# EAGLE design MainBoard (EAGLE 6.4)
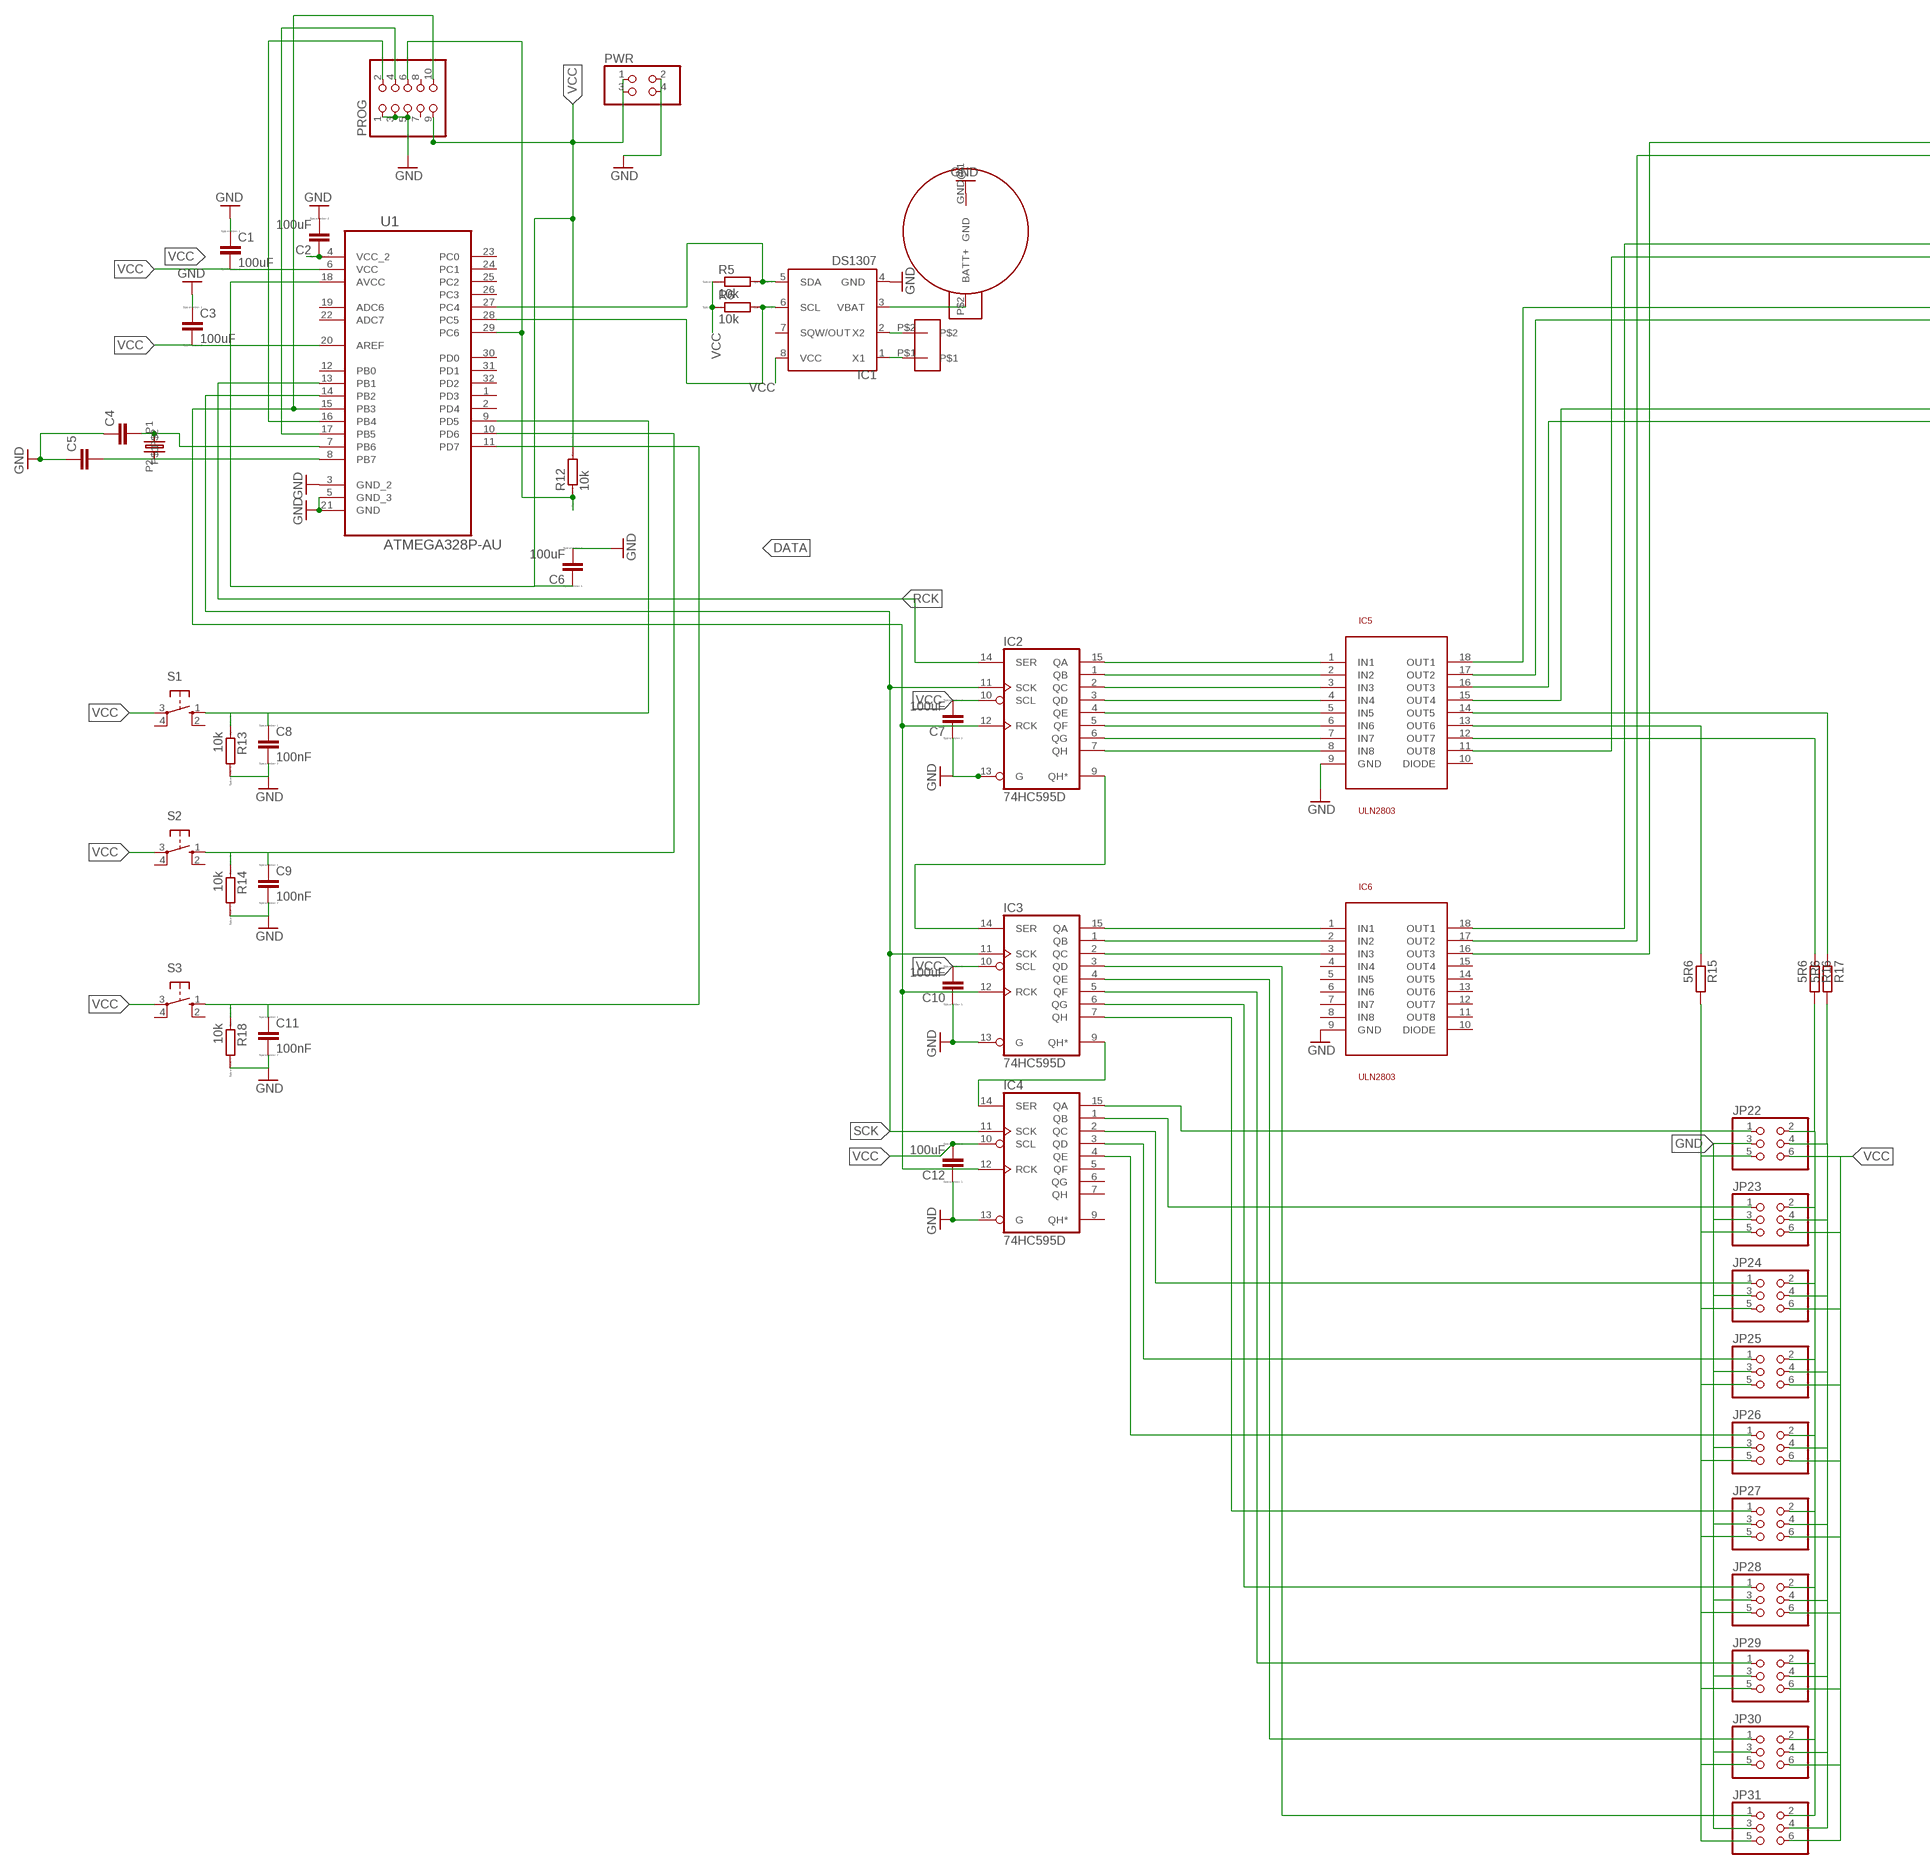
[diagram p0: schematic, sheet 1, part 1 of 2]
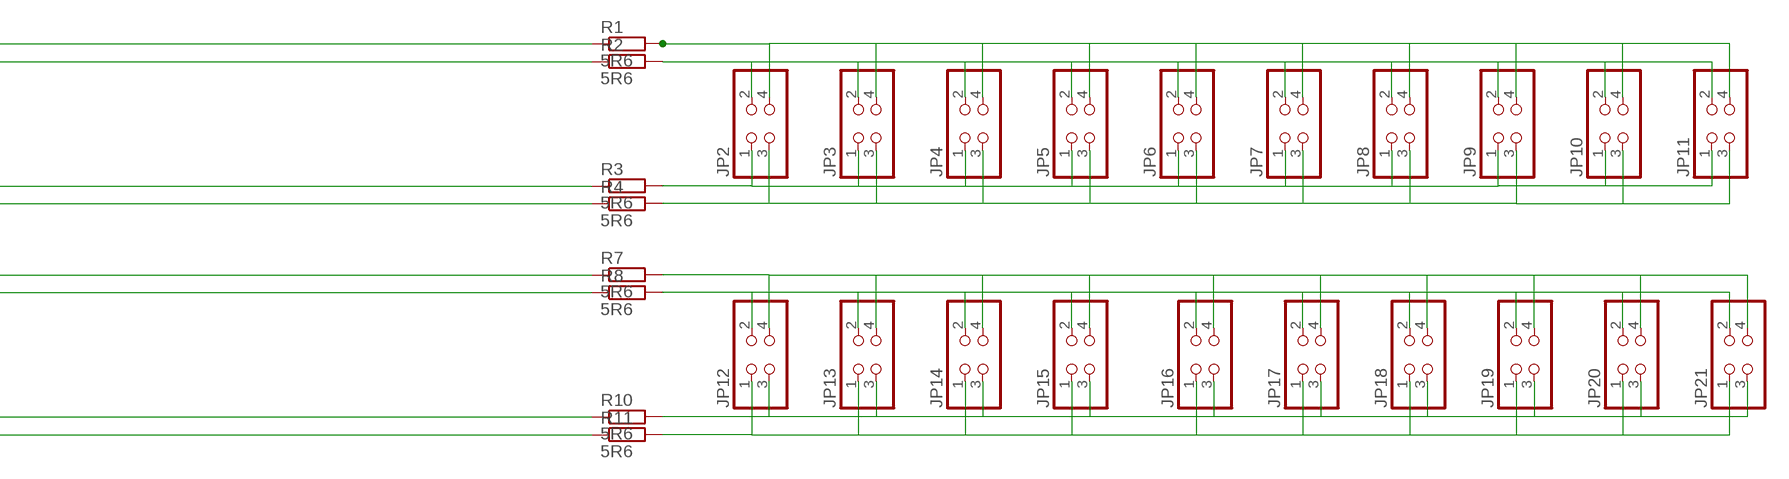
[diagram p1: schematic, sheet 1, part 2 of 2]

## Parts
C1  100uF  CC0603  [C0603]
C2  100uF  CC0603  [C0603]
C3  100uF  CC0603  [C0603]
C4  C-EUC0603  [C0603]
C5  C-EUC0603  [C0603]
C6  100uF  CC0603  [C0603]
C7  100uF  CC0603  [C0603]
C8  100nF  CC0603  [C0603]
C9  100nF  CC0603  [C0603]
C10  100uF  CC0603  [C0603]
C11  100nF  CC0603  [C0603]
C12  100uF  CC0603  [C0603]
IC1  DS1307  [SOIC-8]
IC2  74HC595D  [SO16]
IC3  74HC595D  [SO16]
IC4  74HC595D  [SO16]
IC5  ULN2803  [SO18L]
IC6  ULN2803  [SO18L]
JP2  PINHD-2X2  [2X02]
JP3  PINHD-2X2  [2X02]
JP4  PINHD-2X2  [2X02]
JP5  PINHD-2X2  [2X02]
JP6  PINHD-2X2  [2X02]
JP7  PINHD-2X2  [2X02]
JP8  PINHD-2X2  [2X02]
JP9  PINHD-2X2  [2X02]
JP10  PINHD-2X2  [2X02]
JP11  PINHD-2X2  [2X02]
JP12  PINHD-2X2  [2X02]
JP13  PINHD-2X2  [2X02]
JP14  PINHD-2X2  [2X02]
JP15  PINHD-2X2  [2X02]
JP16  PINHD-2X2  [2X02]
JP17  PINHD-2X2  [2X02]
JP18  PINHD-2X2  [2X02]
JP19  PINHD-2X2  [2X02]
JP20  PINHD-2X2  [2X02]
JP21  PINHD-2X2  [2X02]
JP22  PINHD-2X3  [2X03]
JP23  PINHD-2X3  [2X03]
JP24  PINHD-2X3  [2X03]
JP25  PINHD-2X3  [2X03]
JP26  PINHD-2X3  [2X03]
JP27  PINHD-2X3  [2X03]
JP28  PINHD-2X3  [2X03]
JP29  PINHD-2X3  [2X03]
JP30  PINHD-2X3  [2X03]
JP31  PINHD-2X3  [2X03]
PROG  PINHD-2X5  [2X05]
PWR  PINHD-2X2  [2X02]
R1  5R6  R-EU_R0805  [R0805]
R2  5R6  R-EU_R0805  [R0805]
R3  5R6  R-EU_R0805  [R0805]
R4  5R6  R-EU_R0805  [R0805]
R5  10k  RR0603  [R0603]
R6  10k  RR0603  [R0603]
R7  5R6  R-EU_R0805  [R0805]
R8  5R6  R-EU_R0805  [R0805]
R10  5R6  R-EU_R0805  [R0805]
R11  5R6  R-EU_R0805  [R0805]
R12  10k  RR0603  [R0603]
R13  10k  RR0603  [R0603]
R14  10k  RR0603  [R0603]
R15  5R6  R-EU_R0805  [R0805]
R16  5R6  R-EU_R0805  [R0805]
R17  5R6  R-EU_R0805  [R0805]
R18  10k  RR0603  [R0603]
S1  10-XX  [B3F-10XX]
S2  10-XX  [B3F-10XX]
S3  10-XX  [B3F-10XX]
U1  ATMEGA328P-AU  [QFP80P900X900X120-32N]
U$1  CR2032  [CR2023]
U$2  CC5V-T1A  [CC5V-T1A]
U$3  16,00-MT  [16,00-MT]

## Nets
DATA: IC2.14(SER) U1.13(PB1)
GND: C1.1 C2.2 C3.1 C4.1 C5.1 C6.2 C7.1 C8.2 C9.2 C10.1 C11.2 C12.1 IC1.4(GND) IC2.13(G) IC3.13(G) IC4.13(G) IC5.9(GND) IC6.9(GND) JP22.3 JP23.3 JP24.3 JP25.3 JP26.3 JP27.3 JP28.3 JP29.3 JP30.3 JP31.3 PROG.1 PROG.3 PROG.5 PWR.2 PWR.4 R13.2 R14.2 R18.2 U1.3(GND_2) U1.5(GND_3) U1.21(GND) U$1.GND@1(GND)
N$1: IC5.16(OUT3) R11.1
N$2: IC5.12(OUT7) R16.1
N$3: JP22.2 JP23.2 JP24.2 JP25.2 JP26.2 JP27.2 JP28.2 JP29.2 JP30.2 JP31.2 R16.2
N$4: IC1.2(X2) U$2.P$2
N$5: PROG.6 R12.1 U1.29(PC6)
N$6: IC5.13(OUT6) R15.1
N$7: C8.1 R13.1 S1.1(S) U1.9(PD5)
N$8: IC5.14(OUT5) R17.1
N$9: IC3.9(QH*) IC4.14(SER)
N$10: IC2.9(QH*) IC3.14(SER)
N$11: IC5.18(OUT1) R7.1
N$12: PROG.2 U1.16(PB4)
N$13: IC2.15(QA) IC5.1(IN1)
N$14: C9.1 R14.1 S2.1(S) U1.10(PD6)
N$15: C11.1 R18.1 S3.1(S) U1.11(PD7)
N$16: IC1.1(X1) U$2.P$1
N$17: C5.2 U1.8(PB7) U$3.P2
N$19: IC2.1(QB) IC5.2(IN2)
N$20: IC2.2(QC) IC5.3(IN3)
N$21: IC2.3(QD) IC5.4(IN4)
N$22: IC6.18(OUT1) R3.1
N$23: IC6.17(OUT2) R2.1
N$24: IC6.16(OUT3) R1.1
N$25: IC2.4(QE) IC5.5(IN5)
N$26: IC3.3(QD) JP31.1
N$27: IC1.3(VBAT) U$1.P$2(BATT+)
N$29: PROG.4 U1.17(PB5)
N$32: IC1.5(SDA) R5.2 U1.27(PC4)
N$34: IC2.5(QF) IC5.6(IN6)
N$36: IC2.6(QG) IC5.7(IN7)
N$38: IC4.15(QA) JP22.1
N$39: IC1.6(SCL) R6.2 U1.28(PC5)
N$40: IC4.1(QB) JP23.1
N$42: IC2.7(QH) IC5.8(IN8)
N$44: C4.2 U1.7(PB6) U$3.P1
N$45: IC3.15(QA) IC6.1(IN1)
N$47: JP12.1 JP13.1 JP14.1 JP15.1 JP16.1 JP17.1 JP18.1 JP19.1 JP20.1 JP21.1 R11.2
N$48: IC3.1(QB) IC6.2(IN2)
N$49: IC3.2(QC) IC6.3(IN3)
N$50: IC5.15(OUT4) R10.1
N$51: JP12.3 JP13.3 JP14.3 JP15.3 JP16.3 JP17.3 JP18.3 JP19.3 JP20.3 JP21.3 R10.2
N$52: JP22.5 JP23.5 JP24.5 JP25.5 JP26.5 JP27.5 JP28.5 JP29.5 JP30.5 JP31.5 R15.2
N$53: IC5.11(OUT8) R4.1
N$54: IC5.17(OUT2) R8.1
N$56: IC4.2(QC) JP24.1
N$57: IC4.3(QD) JP25.1
N$58: IC4.4(QE) JP26.1
N$60: IC3.7(QH) JP27.1
N$62: IC3.6(QG) JP28.1
N$69: IC3.5(QF) JP29.1
N$70: IC3.4(QE) JP30.1
N$71: JP2.1 JP3.1 JP4.1 JP5.1 JP6.1 JP7.1 JP8.1 JP9.1 JP10.1 JP11.1 R3.2
N$72: JP22.4 JP23.4 JP24.4 JP25.4 JP26.4 JP27.4 JP28.4 JP29.4 JP30.4 JP31.4 R17.2
N$74: JP2.3 JP3.3 JP4.3 JP5.3 JP6.3 JP7.3 JP8.3 JP9.3 JP10.3 JP11.3 R4.2
N$76: JP2.2 JP3.2 JP4.2 JP5.2 JP6.2 JP7.2 JP8.2 JP9.2 JP10.2 JP11.2 R2.2
N$77: JP2.4 JP3.4 JP4.4 JP5.4 JP6.4 JP7.4 JP8.4 JP9.4 JP10.4 JP11.4 R1.2
N$80: JP12.2 JP13.2 JP14.2 JP15.2 JP16.2 JP17.2 JP18.2 JP19.2 JP20.2 JP21.2 R8.2
N$81: JP12.4 JP13.4 JP14.4 JP15.4 JP16.4 JP17.4 JP18.4 JP19.4 JP20.4 JP21.4 R7.2
RCK: IC2.12(RCK) IC3.12(RCK) IC4.12(RCK) PROG.10 U1.15(PB3)
SCK: IC2.11(SCK) IC3.11(SCK) IC4.11(SCK) U1.14(PB2)
VCC: C1.2 C2.1 C3.2 C6.1 C7.2 C10.2 C12.2 IC1.8(VCC) IC2.10(SCL) IC3.10(SCL) IC4.10(SCL) JP22.6 JP23.6 JP24.6 JP25.6 JP26.6 JP27.6 JP28.6 JP29.6 JP30.6 JP31.6 PROG.9 PWR.1 PWR.3 R5.1 R6.1 R12.2 S1.3(P) S2.3(P) S3.3(P) U1.4(VCC_2) U1.6(VCC) U1.18(AVCC) U1.20(AREF)
Unconnected: IC1.7(SQW/OUT) IC4.5(QF) IC4.6(QG) IC4.7(QH) IC4.9(QH*) IC5.10(DIODE) IC6.4(IN4) IC6.5(IN5) IC6.6(IN6) IC6.7(IN7) IC6.8(IN8) IC6.10(DIODE) IC6.11(OUT8) IC6.12(OUT7) IC6.13(OUT6) IC6.14(OUT5) IC6.15(OUT4) PROG.7 PROG.8 S1.2(S1) S1.4(P1) S2.2(S1) S2.4(P1) S3.2(S1) S3.4(P1) U1.1(PD3) U1.2(PD4) U1.12(PB0) U1.19(ADC6) U1.22(ADC7) U1.23(PC0) U1.24(PC1) U1.25(PC2) U1.26(PC3) U1.30(PD0) U1.31(PD1) U1.32(PD2)

## Power pins joined to a net without a drawn wire
GND: IC2.8(GND) IC3.8(GND) IC4.8(GND)
VCC: IC2.16(VCC) IC3.16(VCC) IC4.16(VCC)

## Library data of the parts
C1-C3 C6-C12 = eagle-ltspice:C: CAPACITOR, European symbol; SPICEMODEL: NONE; SPICEPREFIX: C
C4 C5 = rcl:C-EU: CAPACITOR, European symbol
IC1 = dallas:DS1307: I2C Serial RTC w/56 bytes battery backed RAM
IC2-IC4 = 74xx-eu:74*595: 8-bit SHIFT REGISTER, output latch
IC5 IC6 = uln2803:ULN2803
JP2-JP21 PWR = pinhead:PINHD-2X2: PIN HEADER
JP22-JP31 = pinhead:PINHD-2X3: PIN HEADER
PROG = pinhead:PINHD-2X5: PIN HEADER
R1-R4 R7 R8 R10 R11 R15-R17 = resistor:R-EU_: RESISTOR, European symbol
R5 R6 R12-R14 R18 = eagle-ltspice:R: RESISTOR, European symbol; SPICEMODEL: NONE; SPICEPREFIX: R
S1-S3 = switch-omron:10-XX: OMRON SWITCH; MPN: B3F-1000; OC_FARNELL: 176432; OC_NEWARK: 36M3542
U1 = Atmel_By_element14_Batch_1:ATMEGA328P-AU: 8-bit Microcontroller with In-System Programmable Flash; MPN: ATMEGA328P-AU; OC_FARNELL: 1715486; OC_NEWARK: 14R4631; PACKAGE: TQFP-32; SUPPLIER: Atmel
U$1 = 2032:CR2032
U$2 = cc5v-t1a:CC5V-T1A
U$3 = 1600MT:16,00-MT

## Net classes
0 default: width 0.127 mm, drill 0.508 mm, clearance 0.127 mm

## Board
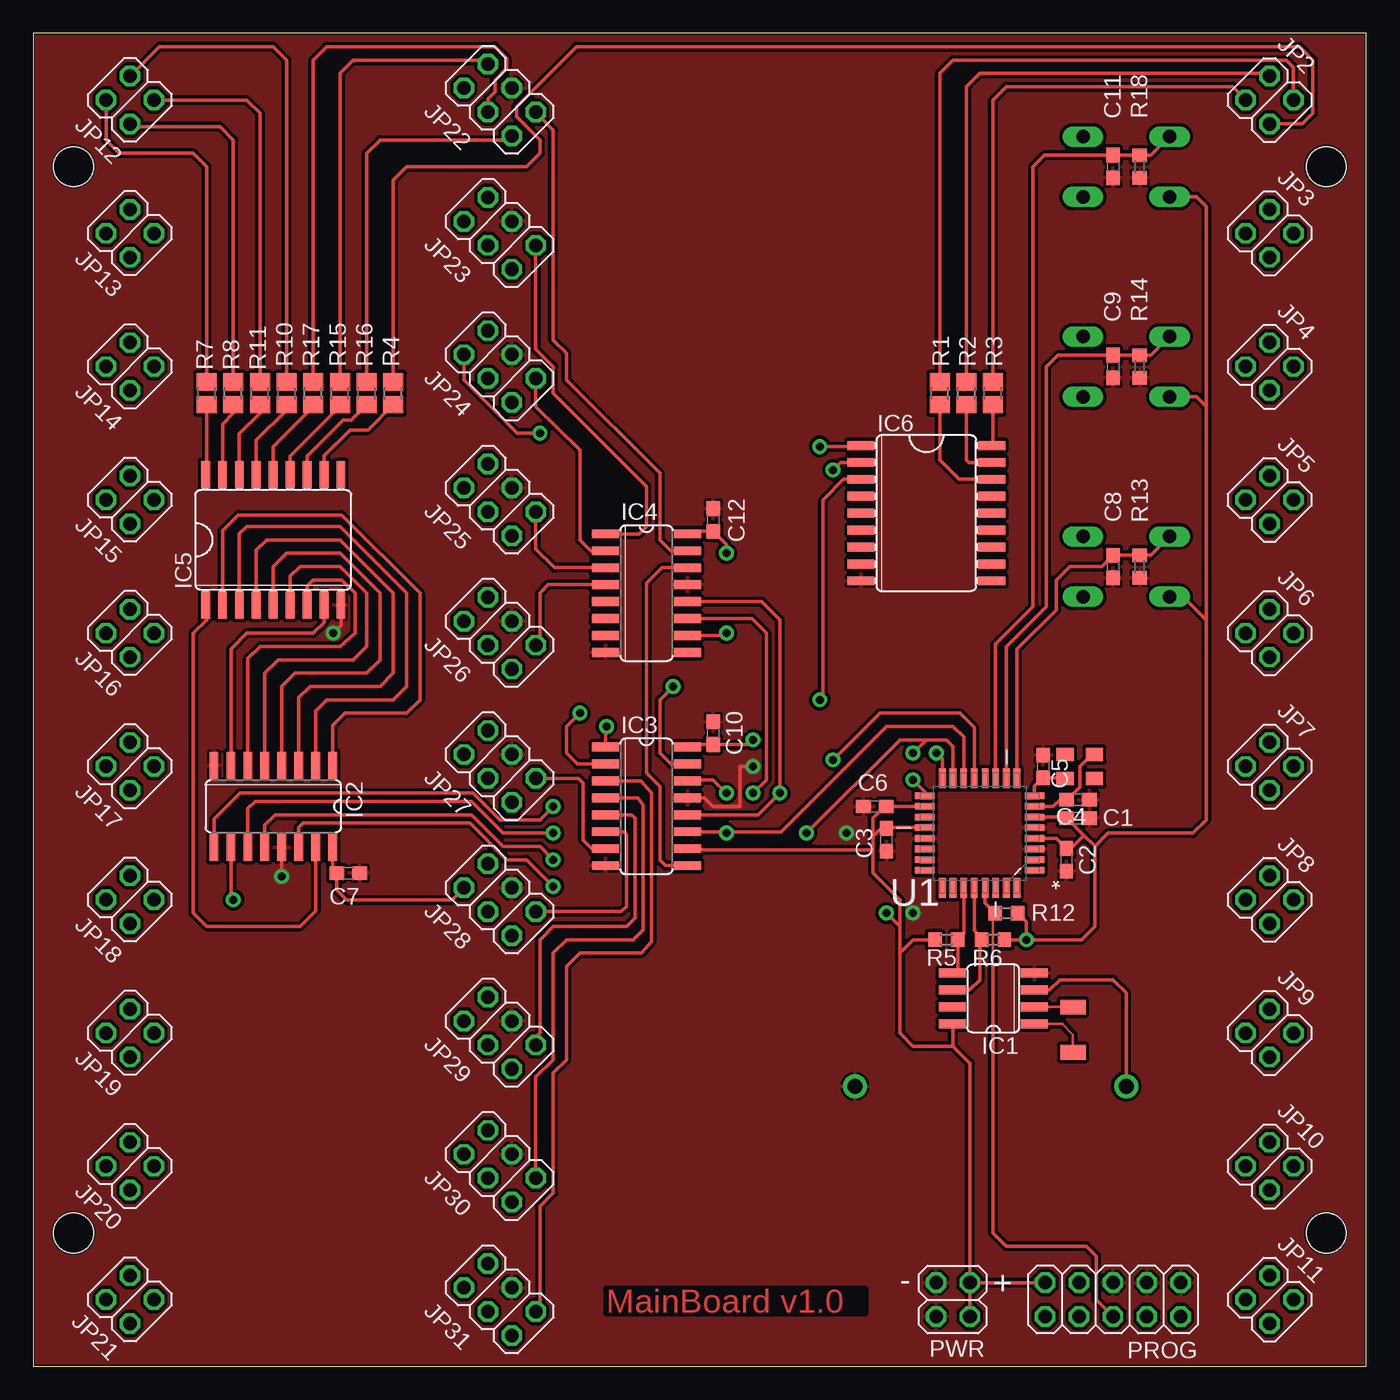
[diagram p2: board, top side]
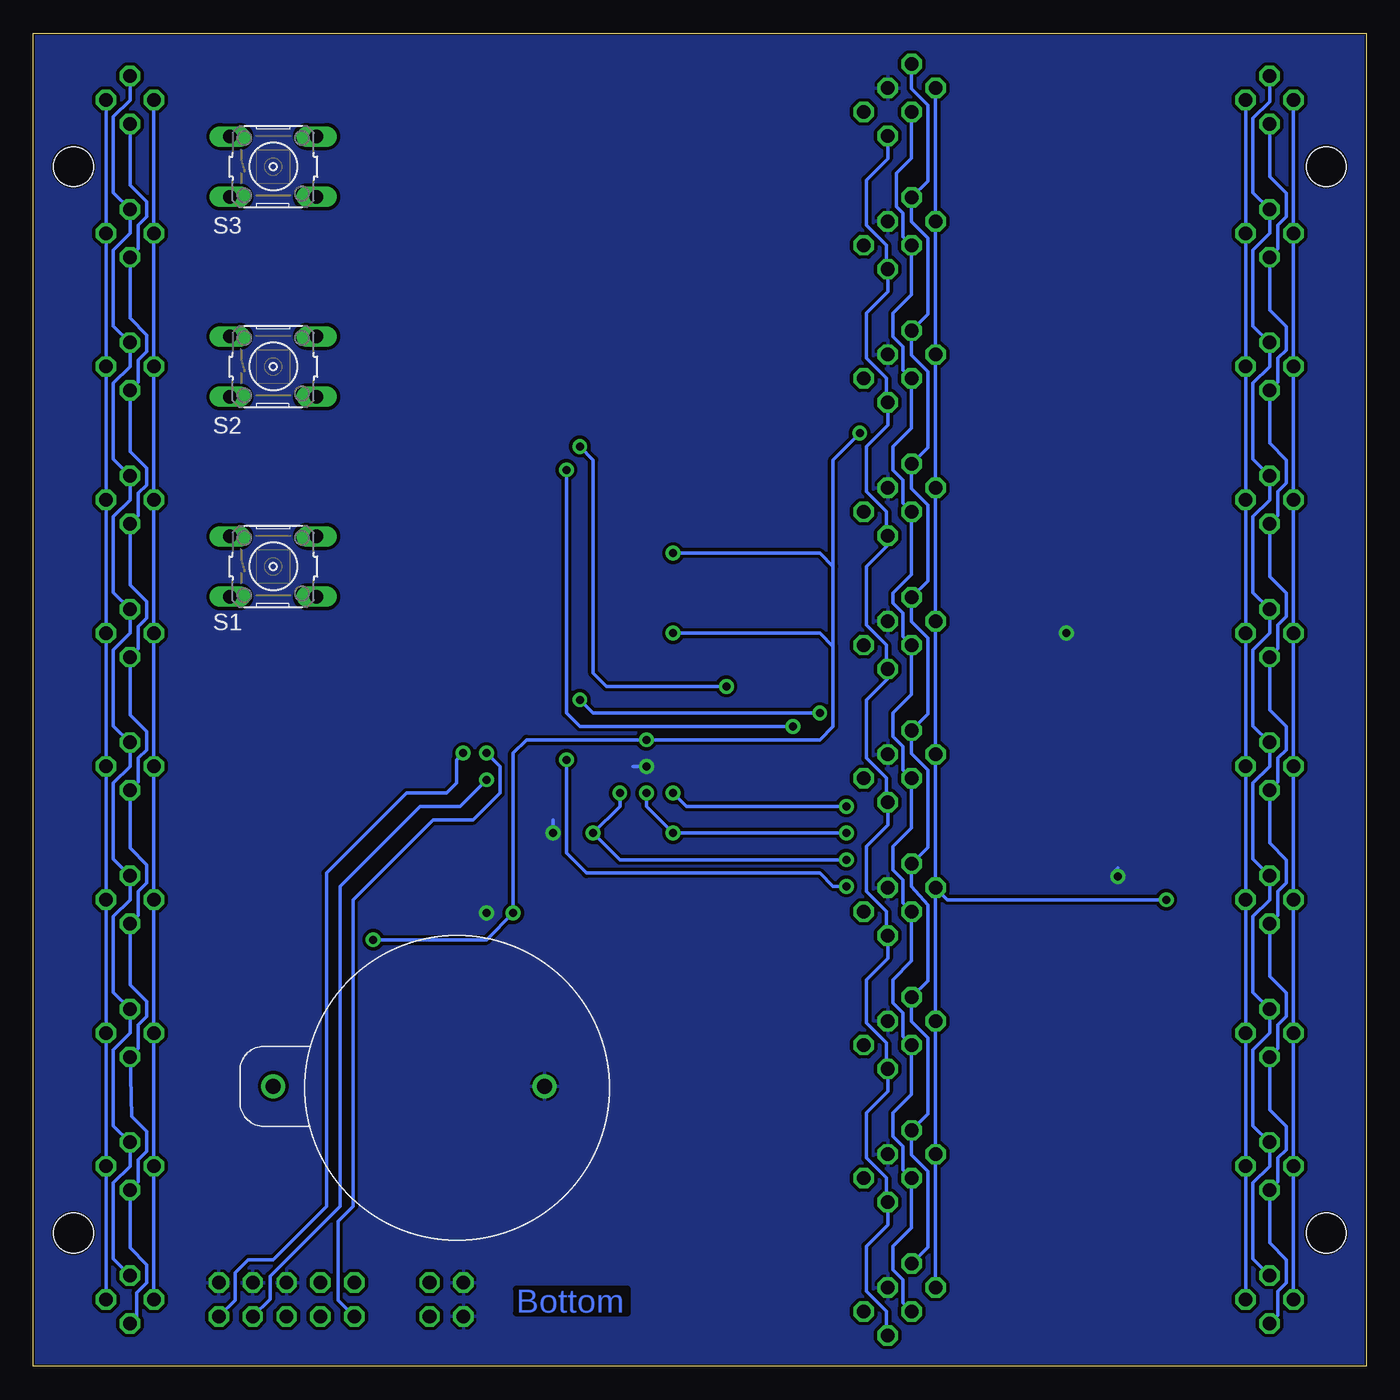
[diagram p3: board, bottom side, seen from below]

Size 100 x 100 mm. Coordinates in mm from the lower left corner, seen from the top.
Outline: 0,0 100,0 100,100 0,100 0,0
Copper layers (1+2*15+16): Top 0.035mm / dielectric 0.2mm / Route2 0.035mm / dielectric 1.4mm / Route15 0.035mm / dielectric 0.2mm / Bottom 0.035mm
Design rules "mohome *": minimum track width 5mil, minimum drill 12mil, track to track 10mil, track to pad 10mil, pad to pad 10mil, via to via 10mil, smd to smd 10mil, copper to edge 5mil, drill to drill 8mil, minimum pad ring 10mil, minimum via ring 10mil, stop-mask expansion 3mil, vias tented up to drill 0mil, thermal gap 8mil
Holes 3 mm at 3,10 3,90 97,90 97,10

### Footprints (pad centres in the part's own frame; a part is rotated, then mirrored left to right if it is on the bottom)
C0603 = smd 1.1 x 1: 1 -0.85,0; 2 0.85,0
SOIC-8 = smd 2.032 x 0.66: 1 -3.073,1.27; 2 -3.073,0; 3 -3.073,-1.27; 4 -3.073,-2.54; 5 3.073,-2.54; 6 3.073,-1.27; 7 3.073,0; 8 3.073,1.27
SO16 = smd 0.66 x 2.032: 1 -4.445,-3.073; 2 -3.175,-3.073; 3 -1.905,-3.073; 4 -0.635,-3.073; 5 0.635,-3.073; 6 1.905,-3.073; 7 3.175,-3.073; 8 4.445,-3.073; 9 4.445,3.073; 10 3.175,3.073; 11 1.905,3.073; 12 0.635,3.073; 13 -0.635,3.073; 14 -1.905,3.073; 15 -3.175,3.073; 16 -4.445,3.073
SO18L = smd 0.66 x 2.032: 1 -5.08,-4.902; 2 -3.81,-4.902; 3 -2.54,-4.902; 4 -1.27,-4.902; 5 0,-4.902; 6 1.27,-4.902; 7 2.54,-4.902; 8 3.81,-4.902; 9 5.08,-4.902; 10 5.08,4.902; 11 3.81,4.902; 12 2.54,4.902; 13 1.27,4.902; 14 0,4.902; 15 -1.27,4.902; 16 -2.54,4.902; 17 -3.81,4.902; 18 -5.08,4.902
2X02 = drill 1.016 octagon: 1 -1.27,-1.27; 2 -1.27,1.27; 3 1.27,-1.27; 4 1.27,1.27
2X03 = drill 1.016 octagon: 1 -2.54,-1.27; 2 -2.54,1.27; 3 0,-1.27; 4 0,1.27; 5 2.54,-1.27; 6 2.54,1.27
2X05 = drill 1.016 octagon: 1 -5.08,-1.27; 2 -5.08,1.27; 3 -2.54,-1.27; 4 -2.54,1.27; 5 0,-1.27; 6 0,1.27; 7 2.54,-1.27; 8 2.54,1.27; 9 5.08,-1.27; 10 5.08,1.27
R0805 = smd 1.3 x 1.5: 1 -0.85,0; 2 0.85,0
R0603 = smd 1 x 1.1: 1 -0.85,0; 2 0.85,0
B3F-10XX = drill 1.016 long: 1 -3.251,2.261; 2 3.251,2.261; 3 -3.251,-2.261; 4 3.251,-2.261
QFP80P900X900X120-32N = smd 1.473 x 0.508: 1 -4.115,2.794; 2 -4.115,2.007; 3 -4.115,1.194; 4 -4.115,0.406; 5 -4.115,-0.406; 6 -4.115,-1.194; 7 -4.115,-2.007; 8 -4.115,-2.794; 17 4.115,-2.794; 18 4.115,-2.007; 19 4.115,-1.194; 20 4.115,-0.406; 21 4.115,0.406; 22 4.115,1.194; 23 4.115,2.007; 24 4.115,2.794 | smd 0.508 x 1.473: 9 -2.794,-4.115; 10 -2.007,-4.115; 11 -1.194,-4.115; 12 -0.406,-4.115; 13 0.406,-4.115; 14 1.194,-4.115; 15 2.007,-4.115; 16 2.794,-4.115; 25 2.794,4.115; 26 2.007,4.115; 27 1.194,4.115; 28 0.406,4.115; 29 -0.406,4.115; 30 -1.194,4.115; 31 -2.007,4.115; 32 -2.794,4.115
CR2023 = drill 1.143 pad 1.778: GND@1 0,5.35; P$2 0,-15
CC5V-T1A = smd 1.1 x 1.9: P$1 -1.7,0; P$2 1.7,0
16,00-MT = smd 1.3 x 1: NC1 1.1,-0.9; NC2 -1.1,0.9; P1 -1.1,-0.9; P2 1.1,0.9

### Placement (x,y rotation side)
C1  78.38,41.12 180 top
C2  77.5,38 270 top
C3  64,39.5 90 top
C4  78.38,42.5 180 top
C5  75.75,45 270 top
C6  63.12,42 180 top
C7  23.62,37 180 top
C8  81,60 270 top
C9  81,75 270 top
C10  51,47.5 270 top
C11  81,90 270 top
C12  51,63.5 270 top
IC1  72.02,26.95 180 top
IC2  18,42 180 top
IC3  46,42 270 top
IC4  46,58 270 top
IC5  18,62 0 top
IC6  67,64 270 top
JP2  92.75,95 315 top
JP3  92.75,85 315 top
JP4  92.75,75 315 top
JP5  92.75,65 315 top
JP6  92.75,55 315 top
JP7  92.75,45 315 top
JP8  92.75,35 315 top
JP9  92.75,25 315 top
JP10  92.75,15 315 top
JP11  92.75,5 315 top
JP12  7.25,95 135 top
JP13  7.25,85 135 top
JP14  7.25,75 135 top
JP15  7.25,65 135 top
JP16  7.25,55 135 top
JP17  7.25,45 135 top
JP18  7.25,35 135 top
JP19  7.25,25 135 top
JP20  7.25,15 135 top
JP21  7.25,5 135 top
JP22  35,95 135 top
JP23  35,85 135 top
JP24  35,75 135 top
JP25  35,65 135 top
JP26  35,55 135 top
JP27  35,45 135 top
JP28  35,35 135 top
JP29  35,25 135 top
JP30  35,15 135 top
JP31  35,5 135 top
PROG  81,5 180 top
PWR  69,5 90 top
R1  68,73 90 top
R2  70,73 90 top
R3  72,73 90 top
R4  27,73 90 top
R5  68.5,32 0 top
R6  72,32 180 top
R7  13,73 90 top
R8  15,73 90 top
R10  19,73 90 top
R11  17,73 90 top
R12  73,34 0 top
R13  83,60 270 top
R14  83,75 270 top
R15  23,73 90 top
R16  25,73 90 top
R17  21,73 90 top
R18  83,90 270 top
S1  82,60 0 bottom
S2  82,75 0 bottom
S3  82,90 0 bottom
U1  71,40 180 top
U$1  67,21 270 bottom
U$2  78,25.25 90 top
U$3  78.5,45 180 top

### Tracks (layer width: path | path; a pad name or v marks a point on that pad's centre or on a via)
DATA  (via drill 0.6)
  Top 0.254: v60,45.5 63.5,49 69.5,49 70.59,47.91 U1.13 | IC2.14 19.91,40.41 20.25,40.75 32.75,40.75 35.5,38 37,38 v39,36
  Bottom 0.254: v39,36 40,36 41,37 58.5,37 60,38.5 v60,45.5
GND  (via drill 0.6)
  Top 0.254: 60.75,39.62 v61,40 | IC5.9 23.08,55.58 v22.5,55 | IC2.13 18.64,37.51 v18.62,36.75 | IC3.13 50.37,42.63 51,42 53,42 53,45 v54,45
  Bottom 0.254: v61,40 61,41 | v22.5,55 23,55 | v18.62,36.75 18.62,37.38 19,37 | v54,45 55,45
  other vias: 66,34
  pour Top: -1.54,100.87 -2,-5 103,-2 103,105
  pour Bottom: 104,103 -2,102 -5,-4 106,-3
N$1
  Top 0.254: IC5.16 15.46,69.96 17,71.5 R11.1
N$2
  Top 0.254: IC5.12 20.54,68.29 23.25,71 23.85,71 R16.1
N$3
  Top 0.254: JP22.2 35.59,92 26,92 25,91 R16.2
  Bottom 0.254: JP22.2 35.9,90.6 37.5,89 37.5,85.62 36,84.12 36,82.41 JP23.2 35.9,80.6 37.5,79 37.5,75.62 36,74.12 36,72.41 JP24.2 35.9,70.6 37.5,69 37.5,65.62 36,64.12 36,62.41 JP25.2 35.9,61.6 37.5,60 37.5,55.62 36,54.12 36,52.41 JP26.2 35.9,51.6 37.5,50 37.5,45.62 36,44.12 36,42.41 JP27.2 35.9,40.6 37.5,39 37.5,35.62 36,34.12 36,32.41 JP28.2 35.9,30.6 37.5,29 37.5,25.75 36,24.25 36,22.41 JP29.2 35.9,20.6 37.5,19 37.5,15.62 36,14.12 36,12.41 JP30.2 35.9,10.6 37.5,9 37.5,5.62 36,4.12 36,2.41 JP31.2
N$4
  Top 0.203: IC1.2 76.1,26.95 U$2.P$2
N$5
  Top 0.178: 72,30 72,33.85
  Top 0.254: PROG.6 81,3.75 79.75,5 79.75,8.25 79,9 73,9 72,10 72,30 | U1.29 71.41,34.74 R12.1 72,33.85
N$6
  Top 0.254: IC5.13 19.27,68.27 22.9,71.9 R15.1
N$7
  Top 0.254: U1.9 73.79,53.79 76.75,56.75 76.75,59 77.75,60 80.15,60 C8.1 R13.1 83.84,60.85 S1.1
N$8
  Top 0.254: IC5.14 18,69 21,72 R17.1
N$9
  Top 0.254: IC4.14 47.16,59.91 46,58.75 46,44.5 47,43.5 47,38 47.45,37.55 IC3.9
N$10  (via drill 0.6)
  Top 0.254: IC2.9 13.55,41.05 15.5,43 33,43 35,41 38,41 v39,42 | v52,43 51,44 49.17,44 IC3.14
  Bottom 0.254: v39,42 51,42 v52,43
N$11
  Top 0.254: R7.1 13,66.98 IC5.18
N$12  (via drill 0.6)
  Top 0.254: U1.16 68.21,45.54 v67.75,46
  Bottom 0.254: v67.75,46 68.25,45.5 68.25,43.75 69,43 72,43 78,37 78,12 82,8 83.88,8 84.88,7 84.88,4.93 PROG.2
N$13
  Top 0.254: IC5.1 13,57.18 13,56 12,55 12,34 13,33 20,33 21.18,34.17 IC2.15
N$14
  Top 0.254: U1.10 73.01,54.01 76,57 76,75 76.85,75.85 C9.1 R14.1 83.84,75.85 S2.1
N$15
  Top 0.254: U1.11 72.19,54.19 75,57 75,90 75.85,90.85 C11.1 R18.1 83.84,90.85 S3.1
N$16
  Top 0.203: U$2.P$1 78,24.88 77.19,25.68 IC1.1
N$17
  Top 0.254: U1.8 75.11,43.52 C5.2 77.35,44.15 U$3.P2
N$19
  Top 0.254: IC5.2 14.19,62.69 15.38,63.88 23.12,63.88 29,58 29,50 28,49 23.38,49 22.45,48.07 IC2.1
N$20
  Top 0.254: IC5.3 15.46,62.46 16,63 23,63 28,58 28,51 27,50 22,50 21.18,49.17 IC2.2
N$21
  Top 0.254: IC5.4 16.73,61.23 17.5,62 23,62 27,58 27,52 26,51 20.75,51 19.91,50.16 IC2.3
N$22
  Top 0.254: IC6.18 72,69.18 R3.1
N$23
  Top 0.254: IC6.17 70.19,67.81 70,68 R2.1
N$24
  Top 0.254: IC6.16 69.46,66.54 68,68 R1.1
N$25
  Top 0.254: IC5.5 18,60 19,61 23,61 26,58 26,53 25,52 19.62,52 18.64,51.01 IC2.4
N$26
  Top 0.254: JP31.1 38,4.5 38,12 39,13 39,22 40,23 40,30 41,31 45.62,31 46.38,31.88 46.38,43 45.59,43.91 IC3.3
N$27
  Top 0.254: U$1.P$2 82,28 81,29 77,29 76.22,28.23 IC1.3
N$29  (via drill 0.6)
  Top 0.254: U1.17 67.21,42.79 v66,44
  Bottom 0.254: v66,44 68,42 71,42 77,36 77,12 82.25,6.75 82.25,5.02 PROG.4
N$32
  Top 0.254: U1.27 69.81,32.46 R5.2 69.35,29.9 IC1.5
N$34
  Top 0.254: IC5.6 19.27,59.27 20,60 23,60 25,58 25,54 24,53 18.38,53 17.36,51.99 IC2.5
N$36
  Top 0.254: IC5.7 20.54,58.54 21,59 23.12,59 24.12,58 24.12,55 23,54 17,54 16.09,53.09 IC2.6
N$38
  Top 0.254: JP22.1 39,92.75 39,77 40,76 40,74 47,67 47,62 47.83,61.17 IC4.15
N$39
  Top 0.254: U1.28 70.59,32.68 R6.2 71,31.85 71,29 70.22,28.23 IC1.6
N$40
  Top 0.254: JP23.1 37.69,76.31 39,75 39,73 46,66 46,63 45.45,62.45 IC4.1
N$42
  Top 0.254: IC5.8 21.81,55.81 21,55 16,55 14.82,53.83 IC2.7
N$44
  Top 0.254: U1.7 76.51,42.01 77,42.5 C4.2 78.5,43.48 78.5,45 79.4,45.9 U$3.P1
N$45  (via drill 0.6)
  Top 0.254: IC3.15 47.83,45.17 47,46 47,50 v48,51 | v59,69 62.02,69 IC6.1
  Bottom 0.254: v48,51 57,51 58,52 58,68 v59,69
N$47
  Top 0.254: R11.2 17,94 16,95 JP12.1
  Bottom 0.254: JP12.1 JP13.1 JP14.1 JP15.1 JP16.1 JP17.1 JP18.1 JP19.1 JP20.1 JP21.1
N$48  (via drill 0.6)
  Top 0.254: IC3.1 42.93,47.93 v43,48 | IC6.2 60.56,67.81 v60,67.25
  Bottom 0.254: v43,48 59,48 60,49 v60,67.25
N$49  (via drill 0.6)
  Top 0.254: IC3.2 40.83,45.17 40,46 40,48 v41,49 | v59,50 59.25,50.25 59.25,65 60.79,66.54 IC6.3
  Bottom 0.254: v41,49 58,49 v59,50
N$50
  Top 0.254: IC5.15 16.73,69.48 19,71.75 R10.1
N$51
  Top 0.254: R10.2 19,98 18,99 9.45,99 JP12.3
  Bottom 0.254: JP12.3 7.25,94.88 8.5,93.62 8.5,88.05 JP13.3 7.25,85 8.5,83.75 8.5,78.05 JP14.3 7.25,75 8.5,73.75 8.5,68.05 JP15.3 7.25,65 8.5,63.75 8.5,58.05 JP16.3 7.25,55 8.5,53.75 8.5,48.05 JP17.3 7.25,45 8.5,43.75 8.5,38.05 JP18.3 7.25,35 8.5,33.75 8.5,28.05 JP19.3 7.25,25 8.5,23.75 8.5,18.05 JP20.3 7.25,15 8.5,13.75 8.5,8.05 JP21.3
N$52
  Top 0.254: JP22.5 33.8,98 24,98 23,97 R15.2
  Bottom 0.254: JP22.5 34.1,95.85 32.88,94.62 32.88,88.92 JP23.5 34.1,85.85 32.88,84.62 32.88,78.92 JP24.5 34.1,75.85 32.88,74.62 32.88,68.92 JP25.5 34.1,65.85 32.88,64.62 32.88,58.92 JP26.5 34.1,55.85 32.88,54.62 32.88,48.92 JP27.5 34.1,45.98 32.88,44.75 32.88,38.92 JP28.5 34.1,35.98 32.88,34.62 32.88,28.92 JP29.5 34.1,25.85 32.88,24.62 32.88,18.92 JP30.5 34.1,15.85 32.88,14.62 32.88,8.92 JP31.5
N$53
  Top 0.254: IC5.11 21.81,68.31 23.75,70.25 25.1,70.25 R4.1
N$54
  Top 0.254: IC5.17 14.19,70.69 15,71.5 R8.1
N$56
  Top 0.254: JP24.1 37.69,72 41,68.75 41,62 41.83,61.17 IC4.2
N$57
  Top 0.254: IC4.3 39.09,59.91 37.69,61.31 JP25.1
N$58
  Top 0.254: JP26.1 38,54.41 38,58 38.63,58.63 IC4.4
N$60
  Top 0.254: JP27.1 40.9,44.1 41.25,43.75 41.25,39.5 41.92,38.83 IC3.7
N$62
  Top 0.254: IC3.6 44.41,40.09 44.5,39.88 44.5,34.5 44.1,34.1 JP28.1
N$69
  Top 0.254: IC3.5 44.88,41.37 45.12,41.12 45.12,33.62 44.5,33 39,33 38,32 38,25 37.69,24.69 JP29.1
N$70
  Top 0.254: IC3.4 45.37,42.63 45.75,42.12 45.75,32.75 45,32 40,32 39,31 39,23 37.69,21.69 JP30.1
N$71
  Top 0.254: R3.2 72,95 73,96 90,96 JP2.1
  Bottom 0.254: JP2.1 JP3.1 JP4.1 JP5.1 JP6.1 JP7.1 JP8.1 JP9.1 JP10.1 JP11.1
N$72
  Top 0.254: JP22.4 34.1,95.1 34.62,95.62 34.62,96.5 35.5,97.38 35.5,98.12 34.62,99 22,99 21,98 R17.2
  Bottom 0.254: JP22.4 34.1,90.65 35.25,89.5 35.25,87 34.75,86.5 34.75,84.75 JP23.4 34.1,80.4 35.5,79 35.5,77.25 34.75,76.5 34.75,74.75 JP24.4 34.1,70.4 35.5,69 35.5,67.25 34.75,66.5 34.75,64.75 JP25.4 34.1,59.4 35.5,58 35.5,57.25 34.75,56.5 34.75,54.75 JP26.4 34.1,50.4 35.5,49 35.5,47.25 34.75,46.5 34.75,44.75 JP27.4 34.1,40.4 35.5,39 35.5,37.25 34.75,36.5 34.75,34.75 JP28.4 34.1,30.4 35.5,29 35.5,27.25 34.75,26.5 34.75,24.75 JP29.4 34.1,20.4 35.5,19 35.5,17.25 34.75,16.5 34.75,14.75 JP30.4 34.1,10.4 35.5,9 35.5,7.25 34.75,6.5 34.75,4.75 JP31.4
N$74
  Top 0.254: R4.2 27,89 28,90 37,90 38,91 38,92 36.25,93.75 36.25,94.5 40.75,99 95,99 96,98 96,94 95.2,93.2 JP2.3
  Bottom 0.254: JP2.3 92.75,88.62 91.5,87.38 91.5,86.25 92.12,85.62 92.12,83.83 JP3.3 92.75,78.62 91.5,77.38 91.5,76.12 92.12,75.5 92.12,73.83 JP4.3 92.75,68.62 91.5,67.38 91.5,66.12 92.12,65.5 92.12,63.83 JP5.3 92.75,58.62 91.5,57.38 91.5,56.12 92.12,55.5 92.12,53.83 JP6.3 92.75,48.88 91.5,47.62 91.5,46.25 92.12,45.62 92.12,43.83 JP7.3 92.75,38.88 91.5,37.62 91.5,36.25 92.12,35.62 92.12,33.83 JP8.3 92.75,28.62 91.5,27.38 91.5,26.25 92.12,25.62 92.12,23.83 JP9.3 92.62,18.75 91.5,17.62 91.5,16.12 92.12,15.5 92.12,13.83 JP10.3 92.75,8.88 91.5,7.62 91.5,6.25 92.25,5.5 92.25,3.7 JP11.3
N$76
  Top 0.254: R2.2 70,96 71,97 92.55,97 JP2.2
  Bottom 0.254: JP2.2 92.75,95 94,93.75 94,88.05 JP3.2 92.75,85 94,83.75 94,78.05 JP4.2 92.75,75 94,73.75 94,68.05 JP5.2 92.75,65 94,63.75 94,58.05 JP6.2 92.75,55 94,53.75 94,48.05 JP7.2 92.75,45 94,43.75 94,38.05 JP8.2 92.75,35 94,33.75 94,28.05 JP9.2 92.75,25 94,23.75 94,18.05 JP10.2 92.75,15 94,13.75 94,8.05 JP11.2
N$77
  Top 0.254: R1.2 68,97 69,98 94,98 94.55,97.45 JP2.4
  Bottom 0.254: JP11.4 JP10.4 JP9.4 JP8.4 JP7.4 JP6.4 JP5.4 JP4.4 JP3.4 JP2.4
N$80
  Top 0.254: R8.2 15,92 14,93 7.45,93 JP12.2
  Bottom 0.254: JP12.2 7.25,89.25 6,88 6,86.25 6.62,85.62 6.62,83.83 JP13.2 7.25,79.25 6,78 6,76.25 6.62,75.62 6.62,73.83 JP14.2 7.25,69.25 6,68 6,66.25 6.62,65.62 6.62,63.83 JP15.2 7.25,59.25 6,58 6,56.25 6.62,55.62 6.62,53.83 JP16.2 7.25,49.25 6,48 6,46.25 6.62,45.62 6.62,43.83 JP17.2 7.25,39.25 6,38 6,36.25 6.62,35.62 6.62,33.83 JP18.2 7.25,29.25 6,28 6,26.25 6.62,25.62 6.62,23.83 JP19.2 7.25,19.25 6,18 6,16.25 6.62,15.62 6.62,13.83 JP20.2 7.25,9.25 6,8 6,6.25 6.62,5.62 6.62,3.83 JP21.2
N$81
  Top 0.254: R7.2 13,90 12,91 6.45,91 5.45,92 JP12.4
  Bottom 0.254: JP12.4 JP13.4 JP14.4 JP15.4 JP16.4 JP17.4 JP18.4 JP19.4 JP20.4 JP21.4
RCK  (via drill 0.6)
  Top 0.254: IC3.12 54.37,41.37 v56,43 56,56 54.63,57.37 IC4.12 | 67,47 65,47 v58,40 | 67,47 68.5,47 68.99,46.51 U1.15 | IC2.12 17.36,40.62 18.12,41.38 32.88,41.38 35.25,39 38,39 v39,38 | v66,46 67,47
  Bottom 0.254: v56,43 56,42 v58,40 56,38 v39,38 | PROG.10 77.12,4.93 77.12,10.88 76,12 76,35 70,41 67,41 65,43 65,45 v66,46
SCK  (via drill 0.6)
  Top 0.254: U1.14 69.81,47.19 69,48 64,48 56.09,40.09 52,40.09 | IC3.11 52,40.09 | IC2.11 16.09,41.84 16.62,42.38 32.88,42.38 35.25,40 v39,40 | v52,40 52,40.09 | IC4.11 53.91,56.09 55,55 55,44 v54,43
  Bottom 0.254: v39,40 v52,40 54,42 v54,43
VCC  (via drill 0.6)
  Top 0.254: IC4.16 49.28,62.65 C12.2 52,61.65 v52,61 | IC2.16 22.45,37.33 C7.2 22.75,36.98 22.75,35.75 23.5,35 31.41,35 JP28.6 | IC3.16 49.07,46.65 C10.2 53.6,46.65 v54,47 | PROG.9 PWR.3 | IC4.10 51.83,54.83 v52,55 | v38,70 36.31,70 32.31,74 JP24.6 | 65,33 65,35 63,37 63,38.75 | 65,33 65,31 | 65,31 65,25 66,24 69,24 | PWR.1 PWR.3 | R12.2 74.5,33.35 v74.5,32 | v74.5,32 78.62,32 79.62,33 79.62,39 | 63,38.75 50.25,38.75 50.08,38.83 IC3.10 | v64,34 65,33 | 88,72 88,87 87.25,87.75 S3.3 | 88,72 88,56 | S1.3 86.26,57.74 88,56 | S2.3 87.26,72.74 88,72 | IC2.10 14.82,35.17 v15,35 | U1.4 76.76,39.59 C2.1 77.85,38.85 78.83,39.83 | U1.18 64.14,42.01 C6.1 63.85,42 63,41.12 63,39.75 | C3.2 64.06,40.41 U1.20 64.41,40.41 63.62,40.38 63,39.75 | 63,39.75 63,38.75 | R6.1 v74.5,32 | R5.1 66,32 65,31 | 69,24 69,25.63 IC1.8 | U1.6 77.46,41.19 C1.2 78.83,39.83 | 88,56 88,41 87,40 80.62,40 79.62,39 | 79.62,39 79.62,39.02 78.83,39.83 | PWR.3 70.27,22.73 69,24
  Bottom 0.254: v52,55 41,55 40,54 | v74.5,32 66,32 v64,34 64,46 63,47 v54,47 41,47 40,48 40,54 | 40,54 40,60 | 40,60 41,61 v52,61 | JP22.6 JP23.6 JP24.6 JP25.6 JP26.6 | JP26.6 JP27.6 JP28.6 | JP28.6 JP29.6 JP30.6 JP31.6 | JP26.6 32.9,55.9 | 40,60 40,68 v38,70 | v15,35 31.41,35 JP28.6

### Text on the board
Top: MainBoard v1.0
Bottom: Bottom
tNames: - | +